# EAGLE design tent2 (EAGLE 9.0.1)
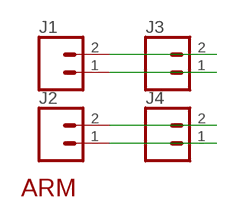
[diagram p0: schematic, sheet 1]

## Parts
J1  CONN_02LOCK  [1X02_LOCK]
J2  CONN_02LOCK  [1X02_LOCK]
J3  CONN_02LOCK  [1X02_LOCK]
J4  CONN_02LOCK  [1X02_LOCK]
U$1  ARMTENT2  [TENT2]

## Nets
V1: J1.1 J3.1
V2: J1.2 J3.2
V3: J2.1 J4.1
V4: J2.2 J4.2

## Library data of the parts
J1-J4 = SparkFun-Connectors:CONN_02: Multi connection point. Often used as Generic Header-pin footprint for 0.1 inch spaced/style header connections On any of the 0.1 inch spaced packages, you can populate with these: Break Away Headers - Straight <https://www.sparkfun.com/products/116> (PRT-00116) Break Away Male Headers - Right Angle <https://www.sparkfun.com/products/553> (PRT-00553) Female Headers <https://www.sparkfun.com/products/115> (PRT-00115) Break Away Headers - Machine Pin <https://www.sparkfun.com/products/117> (PRT-00117) Break Away Female Headers - Swiss Machine Pin <https://www.sparkfun.com/products/743> (PRT-00743) For SCREWTERMINALS and SPRING TERMINALS visit here: Screw Terimnals on SparkFun.com <https://www.sparkfun.com/search/results?term=Screw+Terminals> (5mm/3.5mm/2.54mm spacing) This device is also useful as a general connection point to wire up your design to another part of your project. Our various solder wires solder well into these plated through hole pads. Hook-Up Wire - Assortment (Stranded, 22 AWG) <https://www.sparkfun.com/products/11375> (PRT-11375) Hook-Up Wire - Assortment (Solid Core, 22 AWG) <https://www.sparkfun.com/products/11367> (PRT-11367) View the entire wire category on our website here <https://www.sparkfun.com/categories/141> Special notes: Molex polarized connector foot print use with: PRT-08233 with associated crimp pins and housings. 2.54_SCREWTERM for use with PRT-10571. 3.5mm Screw Terminal footprints for PRT-08084 5mm Screw Terminal footprints for use with PRT-08432
U$1 = arms:ARM

## Board
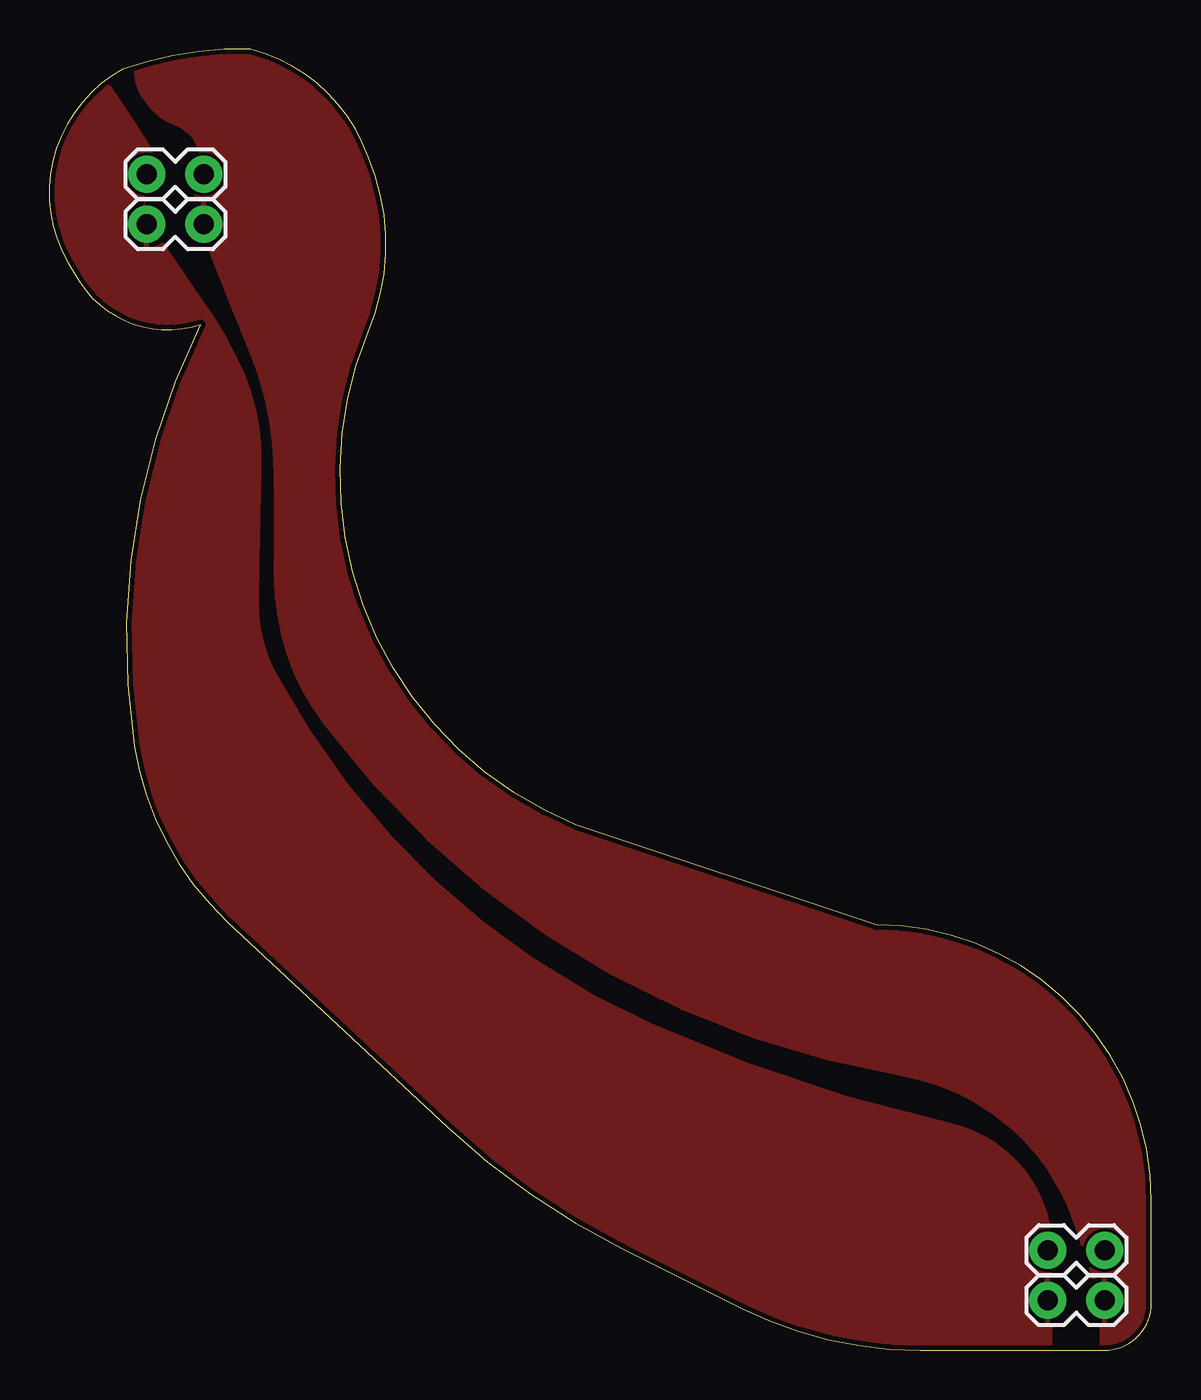
[diagram p1: board, top side]
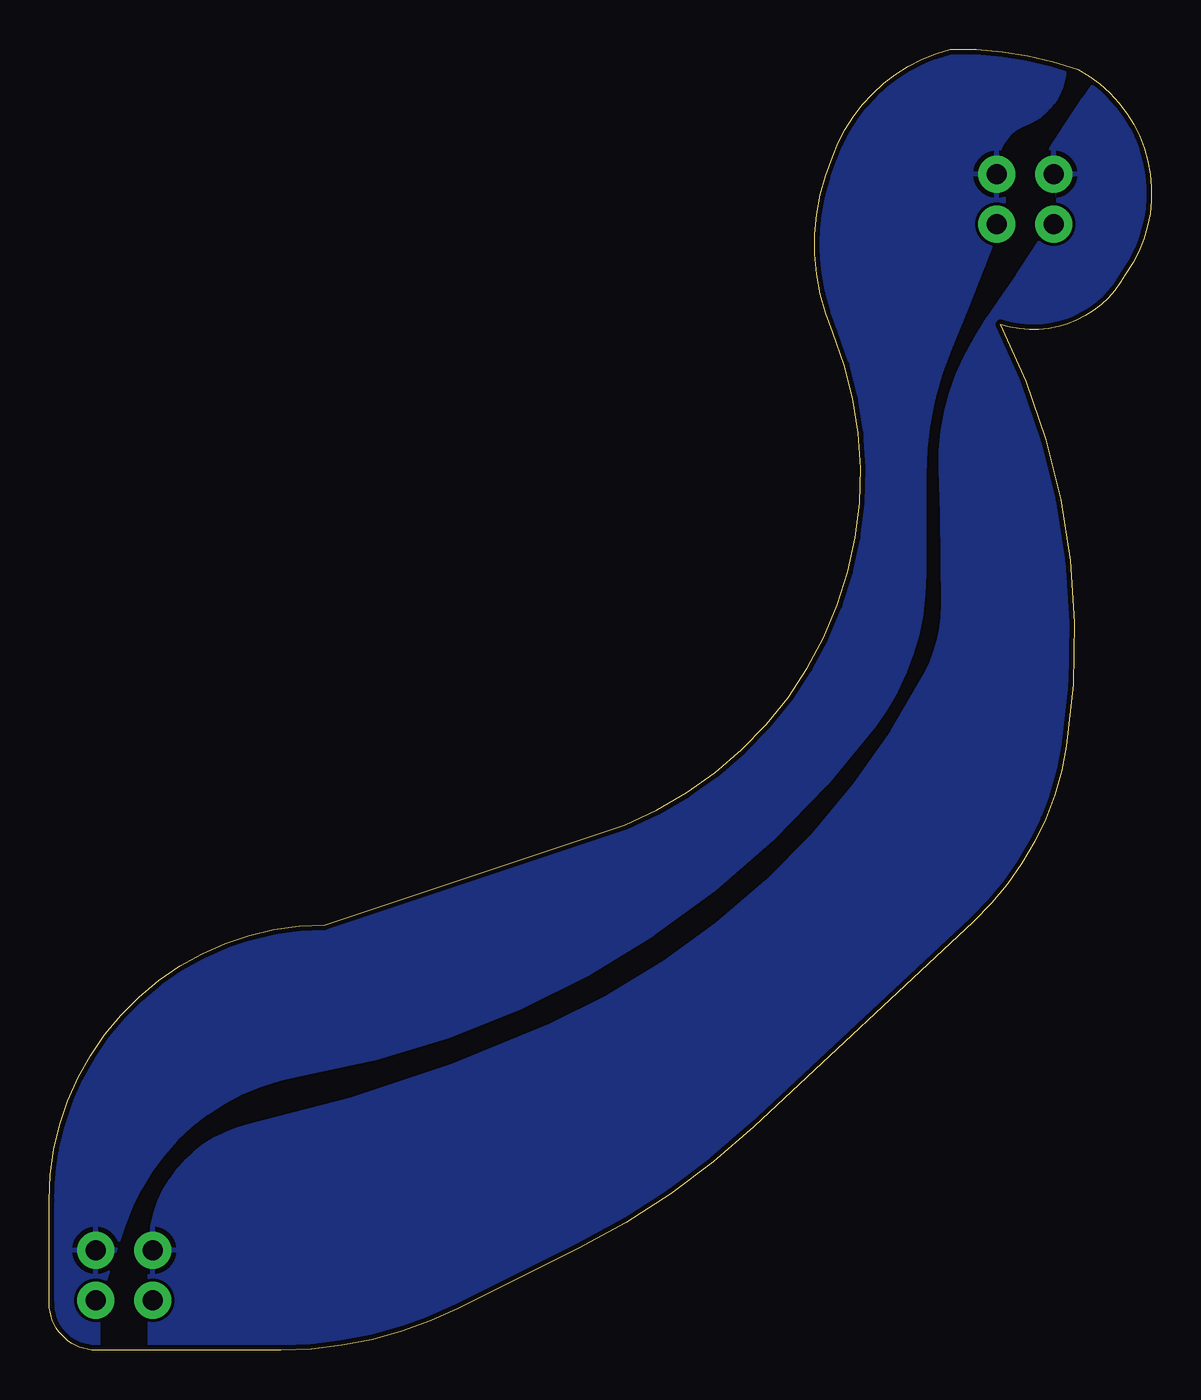
[diagram p2: board, bottom side, seen from below]

Size 55.93 x 66.04 mm. Coordinates in mm from the lower left corner, seen from the top.
Outline: 29.06,5.18 35.15,2.13 arc27 44.19,0 53.55,0 arc90 55.93,2.38 55.93,7.62 arc90 41.96,21.59 26.72,26.67 arc-90 16.18,51.69 arc46 16.18,60.58 arc56 10.21,66.04 arc21 3.73,65.02 arc97 1.32,54.61 arc80 7.67,52.07 arc35 4.32,30.68 arc38 9.04,21.75 20.19,11.34 arc16 29.06,5.18
Copper layers (1*16): Top 0.035mm / dielectric 1.5mm / Bottom 0.035mm
Design rules "default *": minimum track width 6mil, minimum drill 0.35mm, track to track 6mil, track to pad 6mil, pad to pad 6mil, via to via 6mil, smd to smd 6mil, copper to edge 10mil, drill to drill 6mil, minimum pad ring 10mil, minimum via ring 8mil, stop-mask expansion 4mil, vias tented up to drill 0mil, thermal gap 10mil

### Footprints (pad centres in the part's own frame; a part is rotated, then mirrored left to right if it is on the bottom)
1X02_LOCK = drill 1.016 pad 1.88: 1 -0.178,0; 2 2.718,0

### Placement (x,y rotation side)
J1  5.13,59.69 0 top
J2  5.13,57.15 0 top
J3  50.85,5.08 0 top
J4  50.85,2.54 0 top
U$1  1.32,1.27 0 top

### Tracks (layer width: path | path; a pad name or v marks a point on that pad's centre or on a via)
V1
  pour Bottom: 50.85,2.54 50.85,5.08 arc77 45.77,11.43 arc-12 30.53,16.51 arc-38 11.48,34.29 arc-28 10.59,37.85 arc-2 10.72,44.7 arc29 9.45,50.42 arc8 7.67,53.34 arc-4 5.13,57.15 arc-64 5.13,59.69 arc64 5.13,60.96 arc4 2.59,64.77 0.05,64.77 0.05,63.5 0.05,0 6.4,0 50.85,0
V2
  pour Bottom: 53.39,2.54 52.12,6.35 arc62 43.23,13.97 arc-43 14.02,31.75 arc-37 11.48,39.37 arc0 11.48,44.45 arc22 10.21,50.8 arc-1 7.67,57.15 arc-42 7.67,59.69 arc42 7.67,60.96 arc48 6.4,62.23 arc-110 5.13,67.31 58.47,67.31 58.47,0 53.39,0
V3
  pour Top: 50.85,2.54 50.85,5.08 arc77 45.77,11.43 arc-12 30.53,16.51 arc-38 11.48,34.29 arc-28 10.59,37.85 arc-2 10.72,44.7 arc29 9.45,50.42 arc8 7.67,53.34 arc-4 5.13,57.15 arc-64 5.13,59.69 arc64 5.13,60.96 arc4 2.59,64.77 0.05,64.77 0.05,63.5 0.05,0 6.4,0 50.85,0
V4
  pour Top: 53.39,2.54 52.12,6.35 arc62 43.23,13.97 arc-43 14.02,31.75 arc-37 11.48,39.37 arc0 11.48,44.45 arc22 10.21,50.8 arc-1 7.67,57.15 arc-42 7.67,59.69 arc42 7.67,60.96 arc48 6.4,62.23 arc-110 5.13,67.31 58.47,67.31 58.47,0 53.39,0

### Text on the board
tStop: by / @securelyfitz / git.io/sao-arms